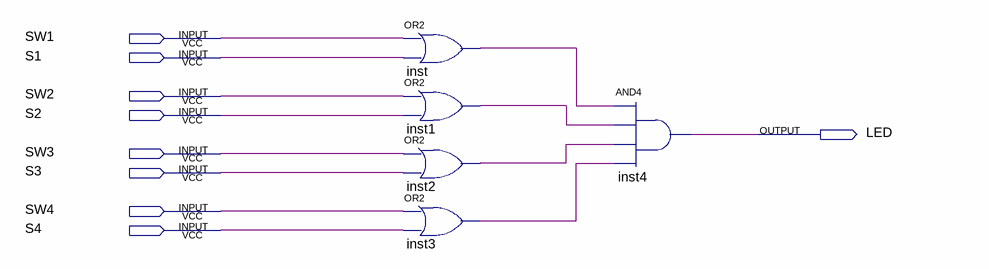
[diagram p0: schematic sheet]
// Quartus schematic LogicLED.bdf as structural Verilog: 5 symbols, 9 pins
module LogicLED (
  input  SW1,
  input  S1,
  input  SW2,
  input  S2,
  input  SW3,
  input  S3,
  input  SW4,
  input  S4,
  output LED
);

  wire inst1_out, inst2_out, inst3_out, inst_out;

  or inst (inst_out, SW1, S1);
  or inst1 (inst1_out, SW2, S2);
  or inst2 (inst2_out, SW3, S3);
  or inst3 (inst3_out, SW4, S4);
  and inst4 (LED, inst_out, inst1_out, inst2_out, inst3_out);
endmodule
